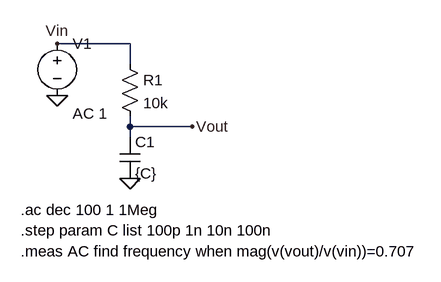
[diagram p0: schematic RC_Low_Pass_Passive_C_Gradient.asc]
RC_Low_Pass_Passive_C_Gradient.asc, the LTspice schematic file:
Version 4
SHEET 1 880 680
WIRE 64 112 -48 112
WIRE 64 144 64 112
WIRE 64 240 64 224
WIRE 160 240 64 240
WIRE 64 256 64 240
FLAG 64 320 0
FLAG -48 192 0
FLAG 160 240 Vout
FLAG -48 112 Vin
SYMBOL res 48 128 R0
SYMATTR InstName R1
SYMATTR Value 10k
SYMBOL voltage -48 96 R0
WINDOW 123 24 124 Left 2
WINDOW 39 0 0 Left 0
SYMATTR InstName V1
SYMATTR Value ""
SYMATTR Value2 AC 1
SYMBOL cap 48 256 R0
SYMATTR InstName C1
SYMATTR Value {C}
TEXT -104 368 Left 2 !.ac dec 100 1 1Meg
TEXT -104 400 Left 2 !.step param C list 100p 1n 10n 100n
TEXT -104 432 Left 2 !.meas AC find frequency when mag(v(vout)/v(vin))=0.707

The netlist it stands for:
* RC_Low_Pass_Passive_C_Gradient.asc
R1 Vin Vout 10k
V1 Vin 0 AC 1
C1 Vout 0 {C}
.ac dec 100 1 1Meg
.step param C list 100p 1n 10n 100n
.meas AC find frequency when mag(v(vout)/v(vin))=0.707
.backanno
.end

* Results of the author's LTspice run, read from the files saved beside the schematic
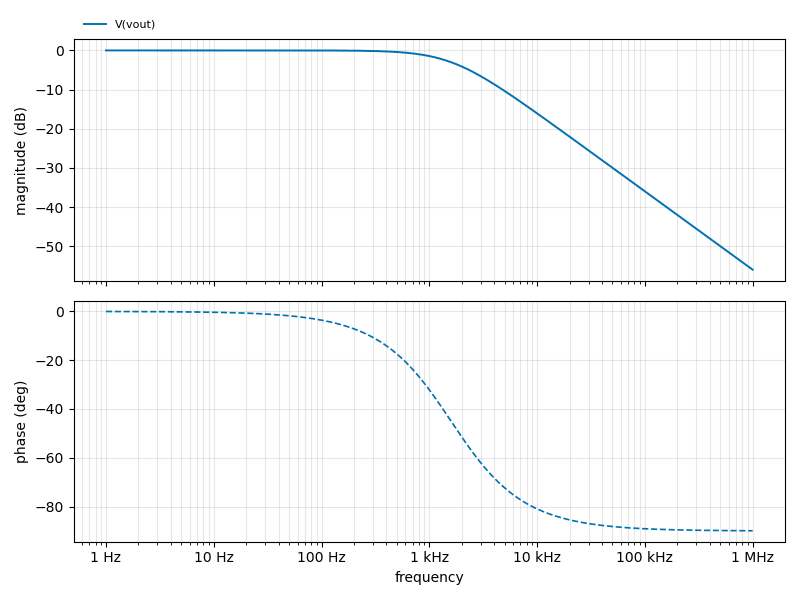
[diagram p1: AC Analysis of RC_Low_Pass_Passive_C_Gradient.asc, plotted from the saved traces]
* AC Analysis, 1 run:
*   V(vout): -0.00 dB at 1 Hz, -55.96 dB at 1 MHz, peak -0.00 dB at 1 Hz, 3 dB below the peak at 1.591 kHz
* From the log:
*   find: mag(v(vout)/v(vin))=0.707 AT 1592.06